# EAGLE design FED_detector (EAGLE 5.11)

## Sheet 1 of 3
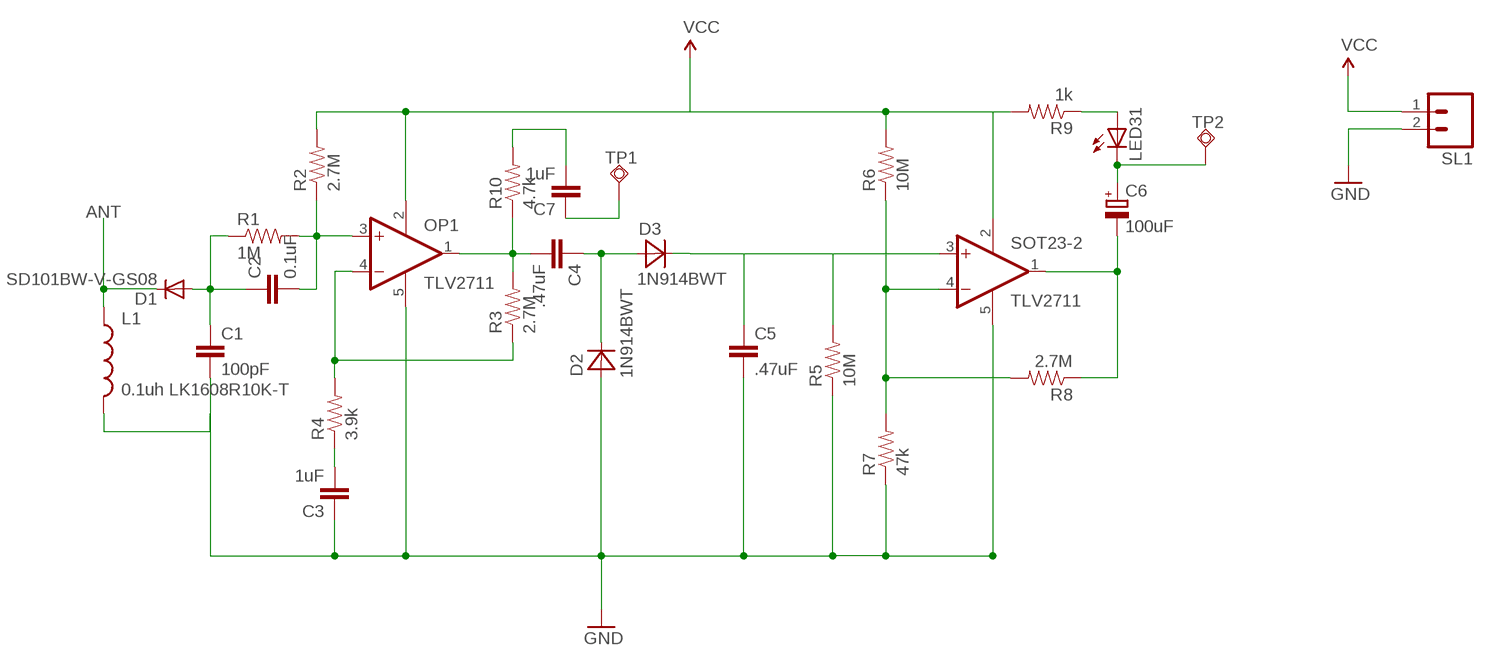
[diagram p0: schematic, sheet 1]

### Parts
C1  100pF  CAP0805  [0805]
C2  0.1uF  CAP0805  [0805]
C3  1uF  CAP0805  [0805]
C4  .47uF  CAP0805  [0805]
C5  .47uF  CAP0805  [0805]
C6  100uF  CAP_POLCASE_B  [CASE_B]
C7  1uF  CAP0805  [0805]
D1  SD101BW-V-GS08  DIODE-SOD123  [SOD123]
D2  1N914BWT  [SOD-523F]
D3  1N914BWT  [SOD-523F]
L1  0.1uh LK1608R10K-T  INDUCTOR0603  [0603]
LED31  LEDCHIPLED_1206  [CHIPLED_1206]
OP1  TLV2711  [SOT23-5]
R1  1M  RESISTOR0805-RES  [0805]
R2  2.7M  RESISTOR0805-RES  [0805]
R3  2.7M  RESISTOR0805-RES  [0805]
R4  3.9k  RESISTOR0805-RES  [0805]
R5  10M  RESISTOR0805-RES  [0805]
R6  10M  RESISTOR0805-RES  [0805]
R7  47k  RESISTOR0805-RES  [0805]
R8  2.7M  RESISTOR0805-RES  [0805]
R9  1k  RESISTOR0805-RES  [0805]
R10  4.7k  RESISTOR0805-RES  [0805]
SL1  M02  [02P]
SOT23-2  TLV2711  [SOT23-5]
TP1  TPSQTP20SQ  [TP20SQ]
TP2  TPSQTP20SQ  [TP20SQ]

### Nets
ANT: D1.C L1.1
GND: C1.2 C3.1 C5.2 D2.2(A) L1.2 OP1.5(V-) R5.1 R7.1 SL1.2 SOT23-2.5(V-) ; also sheet 2,3
N$1: C1.1 C2.1 D1.A R1.1
N$2: C4.1 D2.1(C) D3.2(A)
N$3: LED31.A R9.1
N$4: C2.2 OP1.3(+IN) R1.2 R2.1
N$5: C5.1 D3.1(C) R5.2 SOT23-2.3(+IN)
N$6: C7.2 R10.2
N$7: OP1.4(-IN) R3.1 R4.2
N$8: C4.2 OP1.1(OUT) R3.2 R10.1
N$9: C3.2 R4.1
N$10: R6.1 R7.2 R8.2 SOT23-2.4(-IN)
N$11: C7.1 TP1.TP
N$13: C6.- R8.1 SOT23-2.1(OUT)
N$14: C6.+ LED31.C TP2.TP
VCC: OP1.2(V+) R2.2 R6.2 R9.2 SL1.1 SOT23-2.2(V+) ; also sheet 2,3

## Sheet 2 of 3
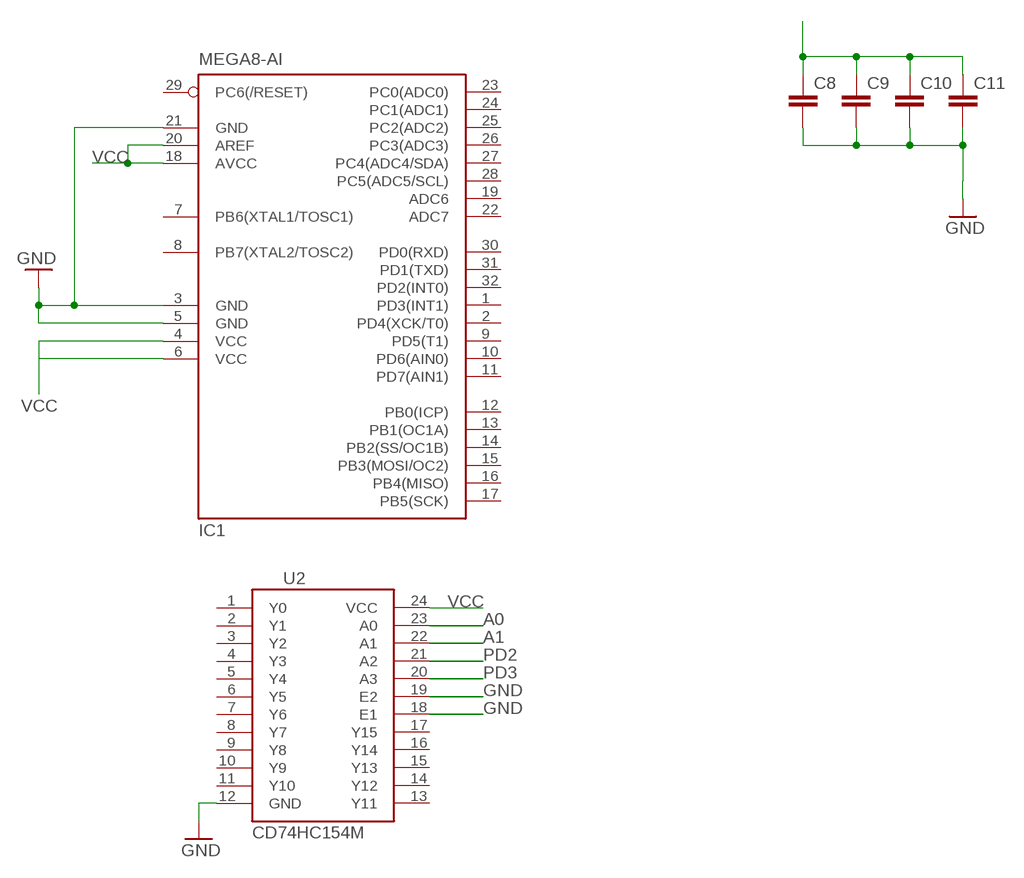
[diagram p1: schematic, sheet 2]

### Parts
C8  CAP0805  [0805]
C9  CAP0805  [0805]
C10  CAP0805  [0805]
C11  CAP0805  [0805]
IC1  MEGA8-AI  [TQFP32-08]
U2  CD74HC154M  [SO-24DW]

### Nets
A0: U2.23(A0)
A1: U2.22(A1)
GND: C8.2 C9.2 C10.2 C11.2 IC1.3(GND) IC1.5(GND) IC1.21(GND) U2.12(GND) U2.18(E1) U2.19(E2) ; also sheet 1,3
PD2: U2.21(A2)
PD3: U2.20(A3)
VCC: C8.1 C9.1 C10.1 C11.1 IC1.4(VCC) IC1.6(VCC) IC1.18(AVCC) IC1.20(AREF) U2.24(VCC) ; also sheet 1,3
Unconnected: IC1.1(PD3(INT1)) IC1.2(PD4(XCK/T0)) IC1.7(PB6(XTAL1/TOSC1)) IC1.8(PB7(XTAL2/TOSC2)) IC1.9(PD5(T1)) IC1.10(PD6(AIN0)) IC1.11(PD7(AIN1)) IC1.12(PB0(ICP)) IC1.13(PB1(OC1A)) IC1.14(PB2(SS/OC1B)) IC1.15(PB3(MOSI/OC2)) IC1.16(PB4(MISO)) IC1.17(PB5(SCK)) IC1.19(ADC6) IC1.22(ADC7) IC1.23(PC0(ADC0)) IC1.24(PC1(ADC1)) IC1.25(PC2(ADC2)) IC1.26(PC3(ADC3)) IC1.27(PC4(ADC4/SDA)) IC1.28(PC5(ADC5/SCL)) IC1.29(PC6(/RESET)) IC1.30(PD0(RXD)) IC1.31(PD1(TXD)) IC1.32(PD2(INT0)) U2.1(Y0) U2.2(Y1) U2.3(Y2) U2.4(Y3) U2.5(Y4) U2.6(Y5) U2.7(Y6) U2.8(Y7) U2.9(Y8) U2.10(Y9) U2.11(Y10) U2.13(Y11) U2.14(Y12) U2.15(Y13) U2.16(Y14) U2.17(Y15)

## Sheet 3 of 3
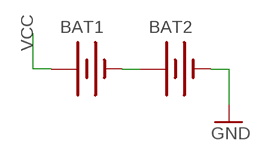
[diagram p2: schematic, sheet 3]

### Parts
BAT1  BATTERY20SMD  [BATTCON_20MM]
BAT2  BATTERY20SMD  [BATTCON_20MM]

### Nets
GND: BAT2.2(-) ; also sheet 1,2
N$19: BAT1.2(-) BAT2.1(+)
VCC: BAT1.1(+) ; also sheet 1,2

## Library data of the parts
BAT1 BAT2 = SparkFun:BATTERY: Battery Holders Various common sizes : AA, AAA, 20mm coin cell and 12mm coin cell.
C1-C5 C7-C11 = SparkFun:CAP: Capacitor Standard 0603 ceramic capacitor, and 0.1" leaded capacitor.
C6 = dp_devices:CAP_POL
D1 = diode:DIODE-: DIODE
D2 D3 = FED_detector:1N914BWT
IC1 = atmel:MEGA8: MICROCONTROLLER 8 Kbytes FLASH, 1 kbytes SRAM, 512 bytes EEPROM, USART, 6-channel 10 bit ADC, 2-channel 8 bit ADC Pin compatible with Atmega48, ATMega88, ATMega168 Source: avr.lbr; MPN: ATMEGA8-16AU; OC_FARNELL: 9171371; OC_NEWARK: 73M8863
L1 = SparkFun:INDUCTOR: Inductors Basic Inductor/Choke - 0603 and 1206. Footprints are not proven and vary greatly between part numbers.
LED31 = FED_detector:LED: LED OSRAM: - CHIPLED LG R971, LG N971, LY N971, LG Q971, LY Q971, LO R971, LY R971 LH N974, LH R974 LS Q976, LO Q976, LY Q976 LO Q996 - Hyper CHIPLED LW Q18S LB Q993, LB Q99A, LB R99A - SideLED LS A670, LO A670, LY A670, LG A670, LP A670 LB A673, LV A673, LT A673, LW A673 LH A674 LY A675 LS A676, LA A676, LO A676, LY A676, LW A676 LS A679, LY A679, LG A679 - Hyper Micro SIDELED® LS Y876, LA Y876, LO Y876, LY Y876 LT Y87S - SmartLED LW L88C, LW L88S LB L89C, LB L89S, LG L890 LS L89K, LO L89K, LY L89K LS L896, LA L896, LO L896, LY L896 - TOPLED LS T670, LO T670, LY T670, LG T670, LP T670 LSG T670, LSP T670, LSY T670, LOP T670, LYG T670 LG T671, LOG T671, LSG T671 LB T673, LV T673, LT T673, LW T673 LH T674 LS T676, LA T676, LO T676, LY T676, LB T676, LH T676, LSB T676, LW T676 LB T67C, LV T67C, LT T67C, LS T67K, LO T67K, LY T67K, LW E67C LS E67B, LA E67B, LO E67B, LY E67B, LB E67C, LV E67C, LT E67C LW T67C LS T679, LY T679, LG T679 LS T770, LO T770, LY T770, LG T770, LP T770 LB T773, LV T773, LT T773, LW T773 LH T774 LS E675, LA E675, LY E675, LS T675 LS T776, LA T776, LO T776, LY T776, LB T776 LHGB T686 LT T68C, LB T68C - Hyper Mini TOPLED® LB M676 - Mini TOPLED Santana® LG M470 LS M47K, LO M47K, LY M47K Source: http://www.osram.convergy.de LUXEON: - LUMILED® LXK2-PW12-R00, LXK2-PW12-S00, LXK2-PW14-U00, LXK2-PW14-V00 LXK2-PM12-R00, LXK2-PM12-S00, LXK2-PM14-U00 LXK2-PE12-Q00, LXK2-PE12-R00, LXK2-PE12-S00, LXK2-PE14-T00, LXK2-PE14-U00 LXK2-PB12-K00, LXK2-PB12-L00, LXK2-PB12-M00, LXK2-PB14-N00, LXK2-PB14-P00, LXK2-PB14-Q00 LXK2-PR12-L00, LXK2-PR12-M00, LXK2-PR14-Q00, LXK2-PR14-R00 LXK2-PD12-Q00, LXK2-PD12-R00, LXK2-PD12-S00 LXK2-PH12-R00, LXK2-PH12-S00 LXK2-PL12-P00, LXK2-PL12-Q00, LXK2-PL12-R00 Source: www.luxeon.com KINGBRIGHT: KA-3528ASYC Source: www.kingbright.com
OP1 SOT23-2 = FED_detector:TLV2711
R1-R10 = SparkFun:RESISTOR: Resistor Basic schematic elements and footprints for 0603, 1206, and PTH resistors.
SL1 = PWM:M02: AMP QUICK CONNECTOR; OC_FARNELL: unknown; OC_NEWARK: unknown
TP1 TP2 = testpad:TPSQ: Test pad
U2 = SparkFun:CD74HC154M: High-Speed CMOS Logic 4- to 16-Line Decoder/Demultiplexer

## Board
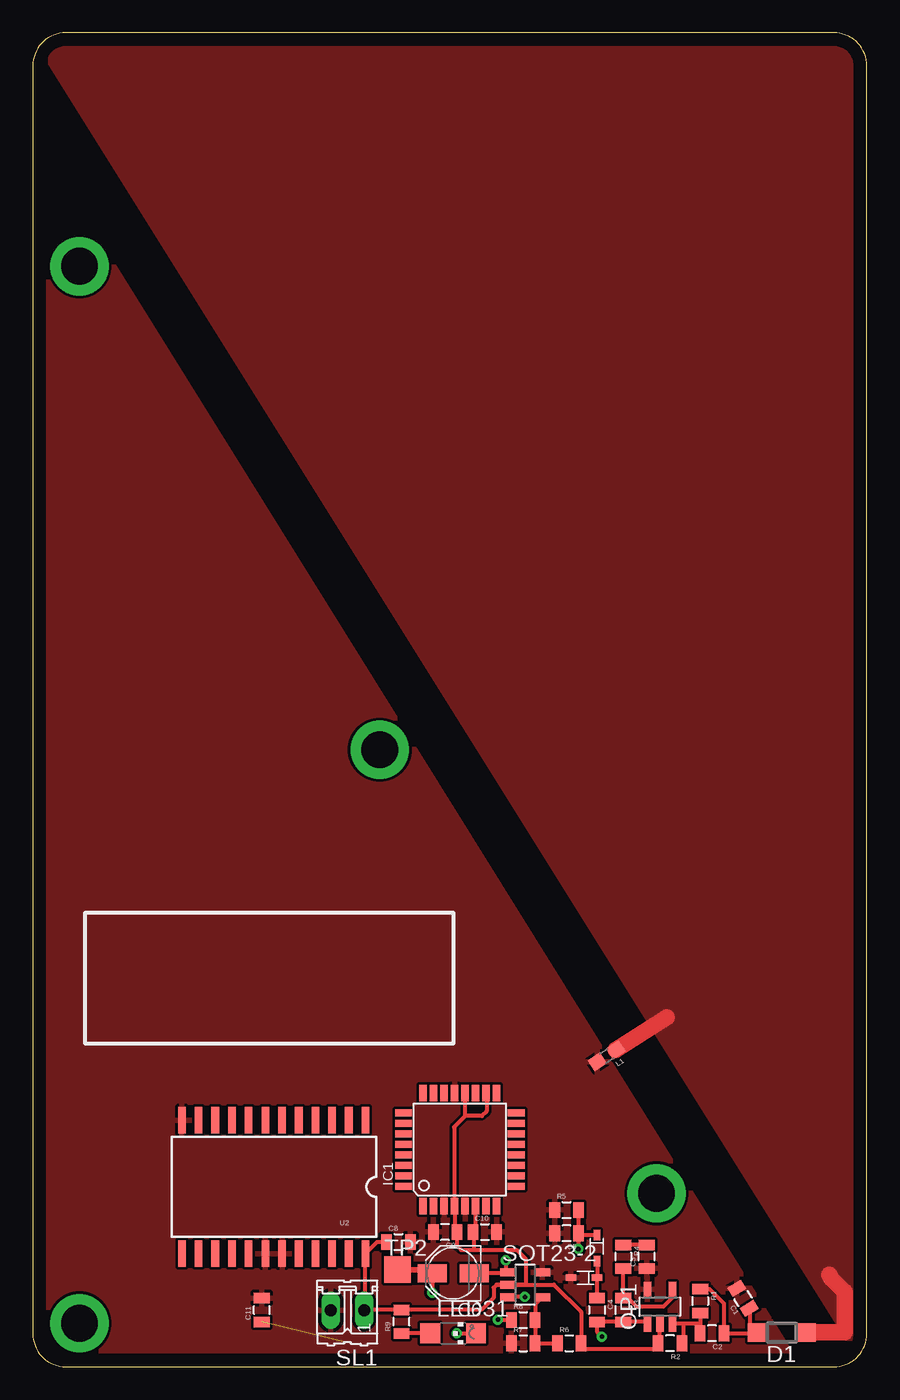
[diagram p3: board, top side]
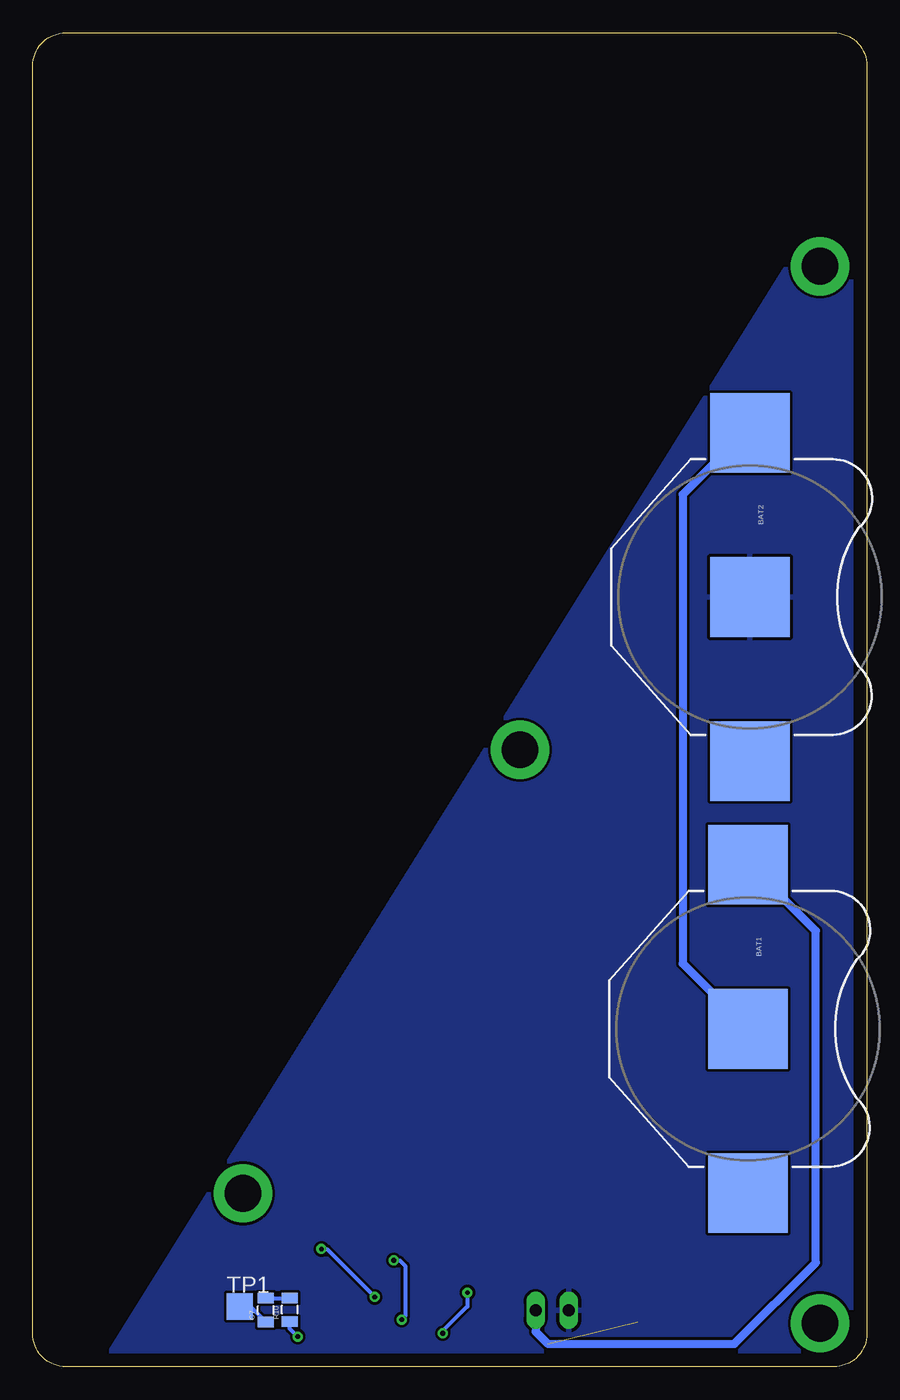
[diagram p4: board, bottom side, seen from below]

Size 63.5 x 101.6 mm. Coordinates in mm from the lower left corner, seen from the top.
Outline: 0,2.5 arc90 2.5,0 61,0 arc90 63.5,2.5 63.5,99.1 arc90 61,101.6 2.5,101.6 arc90 0,99.1 0,2.5
Copper layers (1*16): Top 0.035mm / dielectric 1.5mm / Bottom 0.035mm
Design rules "default": minimum track width 10mil, minimum drill 24mil, track to track 8mil, track to pad 8mil, pad to pad 8mil, via to via 8mil, smd to smd 8mil, copper to edge 40mil, drill to drill 8mil, minimum pad ring 10mil, minimum via ring 8mil, stop-mask expansion 4mil, vias tented up to drill 0mil, thermal gap 10mil

### Footprints (pad centres in the part's own frame; a part is rotated, then mirrored left to right if it is on the bottom)
BATTCON_20MM = smd 6.07 x 6.07: 1 -12.5,0; 2 0,0; 3 12.5,0
0805 = smd 0.8 x 1.2: 1 -0.9,0; 2 0.9,0
CASE_B = smd 2.2 x 1.4: + 1.6,0; - -1.6,0
SOD123 = smd 1.4 x 1.4: A 1.9,0; C -1.9,0
SOD-523F = smd 0.5 x 0.8: 1 0,1; 2 0,-1
TQFP32-08 = smd 1.27 x 0.559: 1 -4.293,2.8; 2 -4.293,2; 3 -4.293,1.2; 4 -4.293,0.4; 5 -4.293,-0.4; 6 -4.293,-1.2; 7 -4.293,-2; 8 -4.293,-2.8; 17 4.293,-2.8; 18 4.293,-2; 19 4.293,-1.2; 20 4.293,-0.4; 21 4.293,0.4; 22 4.293,1.2; 23 4.293,2; 24 4.293,2.8 | smd 0.559 x 1.27: 9 -2.8,-4.293; 10 -2,-4.293; 11 -1.2,-4.293; 12 -0.4,-4.293; 13 0.4,-4.293; 14 1.2,-4.293; 15 2,-4.293; 16 2.8,-4.293; 25 2.8,4.293; 26 2,4.293; 27 1.2,4.293; 28 0.4,4.293; 29 -0.4,4.293; 30 -1.2,4.293; 31 -2,4.293; 32 -2.8,4.293
0603 = smd 1.1 x 1: 1 -0.85,0; 2 0.85,0
CHIPLED_1206 = smd 1.5 x 1.5: A 0,-1.75; C 0,1.75
SOT23-5 = smd 0.6 x 1.2: 1 -0.95,-1.306; 2 0,-1.306; 3 0.95,-1.306; 4 0.95,1.306; 5 -0.95,1.306
02P = drill 0.914 long: 1 -1.27,0; 2 1.27,0
TP20SQ = smd 2 x 2: TP 0,0
SO-24DW = smd 0.584 x 2.032: 1 -6.35,-5.08; 2 -5.08,-5.08; 3 -3.81,-5.08; 4 -2.54,-5.08; 5 -1.27,-5.08; 6 0,-5.08; 7 1.27,-5.08; 8 2.54,-5.08; 9 3.81,-5.08; 10 5.08,-5.08; 11 6.35,-5.08; 12 7.62,-5.08; 13 7.62,5.08; 14 6.35,5.08; 15 5.08,5.08; 16 3.81,5.08; 17 2.54,5.08; 18 1.27,5.08; 19 0,5.08; 20 -1.27,5.08; 21 -2.54,5.08; 22 -3.81,5.08; 23 -5.08,5.08; 24 -6.35,5.08

### Placement (x,y rotation side)
BAT1  9.05,25.73 270 bottom
BAT2  8.9,58.62 270 bottom
C1  54.08,5.21 122 top
C2  51.71,2.54 180 top
C3  46.74,8.38 90 top
C4  42.95,4.32 270 top
C5  40.64,10.16 180 top
C6  32,7.11 180 top
C7  45.77,4.32 90 bottom
C8  27.84,9.5 0 top
C9  31.39,10.26 180 top
C10  34.42,10.26 0 top
C11  17.42,4.32 90 top
D1  57.02,2.62 180 top
D2  41.96,6.78 270 top
D3  42.95,9.04 0 top
IC1  32.51,16.54 90 top
L1  43.69,23.67 213 top
LED31  32,2.54 270 top
OP1  47.75,4.57 0 top
R1  50.83,5 270 top
R2  48.51,1.78 180 top
R3  44.96,4.32 270 top
R4  44.96,8.38 270 top
R5  40.64,11.94 0 top
R6  40.84,1.78 0 top
R7  37.34,1.78 0 top
R8  37.34,3.56 0 top
R9  28.07,3.43 90 top
R10  43.94,4.34 90 bottom
SL1  23.95,4.29 180 top
SOT23-2  37.49,6.25 270 top
TP1  47.75,4.57 0 bottom
TP2  27.76,7.39 0 top
U2  18.97,13.69 180 top

### Tracks (layer width: path | path; a pad name or v marks a point on that pad's centre or on a via)
ANT
  Top 1.27: 48.28,26.59 L1.1 | 60.63,7.01 60.81,6.73 60.83,6.71 61.82,5.71 61.82,2.9 61.82,2.62 D1.C
  pour Top: 63.5,0 63.5,101.6 0,101.6
GND
  pour Top: 0,0 58.47,-0.2 0.64,92.71
  pour Bottom: 0.05,0 58.34,-0.03 0.03,93.47
N$1
  Top 0.305: C2.1 52.63,2.54 | C1.1 54.62,4.38 54.62,2.49 D1.A 54.78,2.54 C2.1 | R1.1 50.84,5.92 51.51,5.92 52.61,4.81 C2.1
N$2
  Top 0.305: C4.1 D2.1 D3.2
N$3
  Top 0.305: R9.1 LED31.A
N$4
  Top 0.305: R1.2 C2.2 50.81,3.27 49.53,3.27 | 49.53,3.27 OP1.3 | R2.1 49.53,1.78 49.53,3.27
N$5  (via drill 0.36)
  Top 0.305: R5.2 C5.1 | C5.1 41.66,10.04 D3.1 | SOT23-2.3 36.2,5.31 v37.47,5.31 | v41.53,8.97 v41.54,8.98 C5.1
  Bottom 0.305: v37.47,5.31 41.12,8.97 v41.53,8.97
N$6
  Bottom 0.305: R10.2 43.97,5.22 C7.2
N$7
  Top 0.305: OP1.4 48.77,5.81 48.77,5.33 48.01,4.57 45.97,4.57 45.33,5.22 R3.1 R4.2
N$8  (via drill 0.36)
  Top 0.305: OP1.1 46.65,3.42 R3.2 C4.2 42.95,2.67 v43.33,2.29
  Bottom 0.305: v43.33,2.29 43.94,2.9 R10.1
N$9
  Top 0.305: C3.2 R4.1
N$10
  Top 0.305: R6.1 R7.2 R8.2 38.24,4.74 SOT23-2.4
N$11
  Bottom 0.305: C7.1 46.92,4.57 TP1.TP
N$13  (via drill 0.36)
  Top 0.305: C6.- 36.1,7.11 SOT23-2.1 36.02,7.37 v36.02,8.1 | R8.1 36.41,3.58 v35.41,3.58
  Bottom 0.305: v35.41,3.58 35.15,3.83 35.15,7.7 35.56,8.1 v36.02,8.1
N$14  (via drill 0.36)
  Top 0.305: v32.28,2.54 LED31.C | v30.4,5.64 | C6.+ v30.4,5.64
  Top 0.406: TP2.TP 30.4,7.39 C6.+
  Bottom 0.305: v30.4,5.64 30.4,4.6 32.28,2.72 v32.28,2.54
N$15  (via drill 2.79 pad 4.45)
  other vias: 3.56,83.82
N$16  (via drill 2.79 pad 4.45)
  other vias: 3.56,3.3
N$17  (via drill 2.79 pad 4.45)
  other vias: 47.5,13.21
N$18  (via drill 2.79 pad 4.45)
  other vias: 26.42,46.99
N$19
  Bottom 0.61: BAT2.1 9.35,71.12 14.02,66.45 14.02,30.7 BAT1.2
VCC  (1 unrouted)
  Top 0.305: OP1.2 47.75,2.29 47.75,1.92 R2.2 47.61,1.35 41.91,1.35 41.91,1.78 R6.2 41.74,4.18 39.67,6.25 37.52,6.25 | 37.52,6.25 SOT23-2.2 35.31,6.25 | 35.31,6.25 35.08,6.02 35.08,5.26 34.16,4.34 28.08,4.34 R9.2 25.26,4.33 | 25.26,4.33 SL1.1 25.32,4.39 | 35.31,6.25 37.49,6.25 | 25.26,4.33 25.32,4.39 | C9.1 32.28,9.22 32.61,8.89 33.63,8.89 | 33.63,8.89 36.83,8.89 37.52,8.2 37.52,6.25 | C10.1 33.71,10.46 | C10.1 33.63,10.15 33.63,8.89 | 32.11,10.26 C9.1 | C8.1 26.21,9.5 U2.24 25.32,4.39 | 32.11,10.26 IC1.4 32.08,12.27 32.08,18.26 32.91,19.09 | 32.11,10.26 C9.1 | IC1.6 33.71,10.26 C10.1 | 32.91,19.09 IC1.20 | IC1.18 34.54,20.8 34.54,19.46 34.18,19.09 32.91,19.09
  Bottom 0.61: BAT1.1 8.92,38.23 3.89,33.2 3.89,7.92 10.08,1.73 24.28,1.73 25.22,2.67 SL1.1